# EAGLE design HelvePicV2_0fSMD (EAGLE 7.5.0)
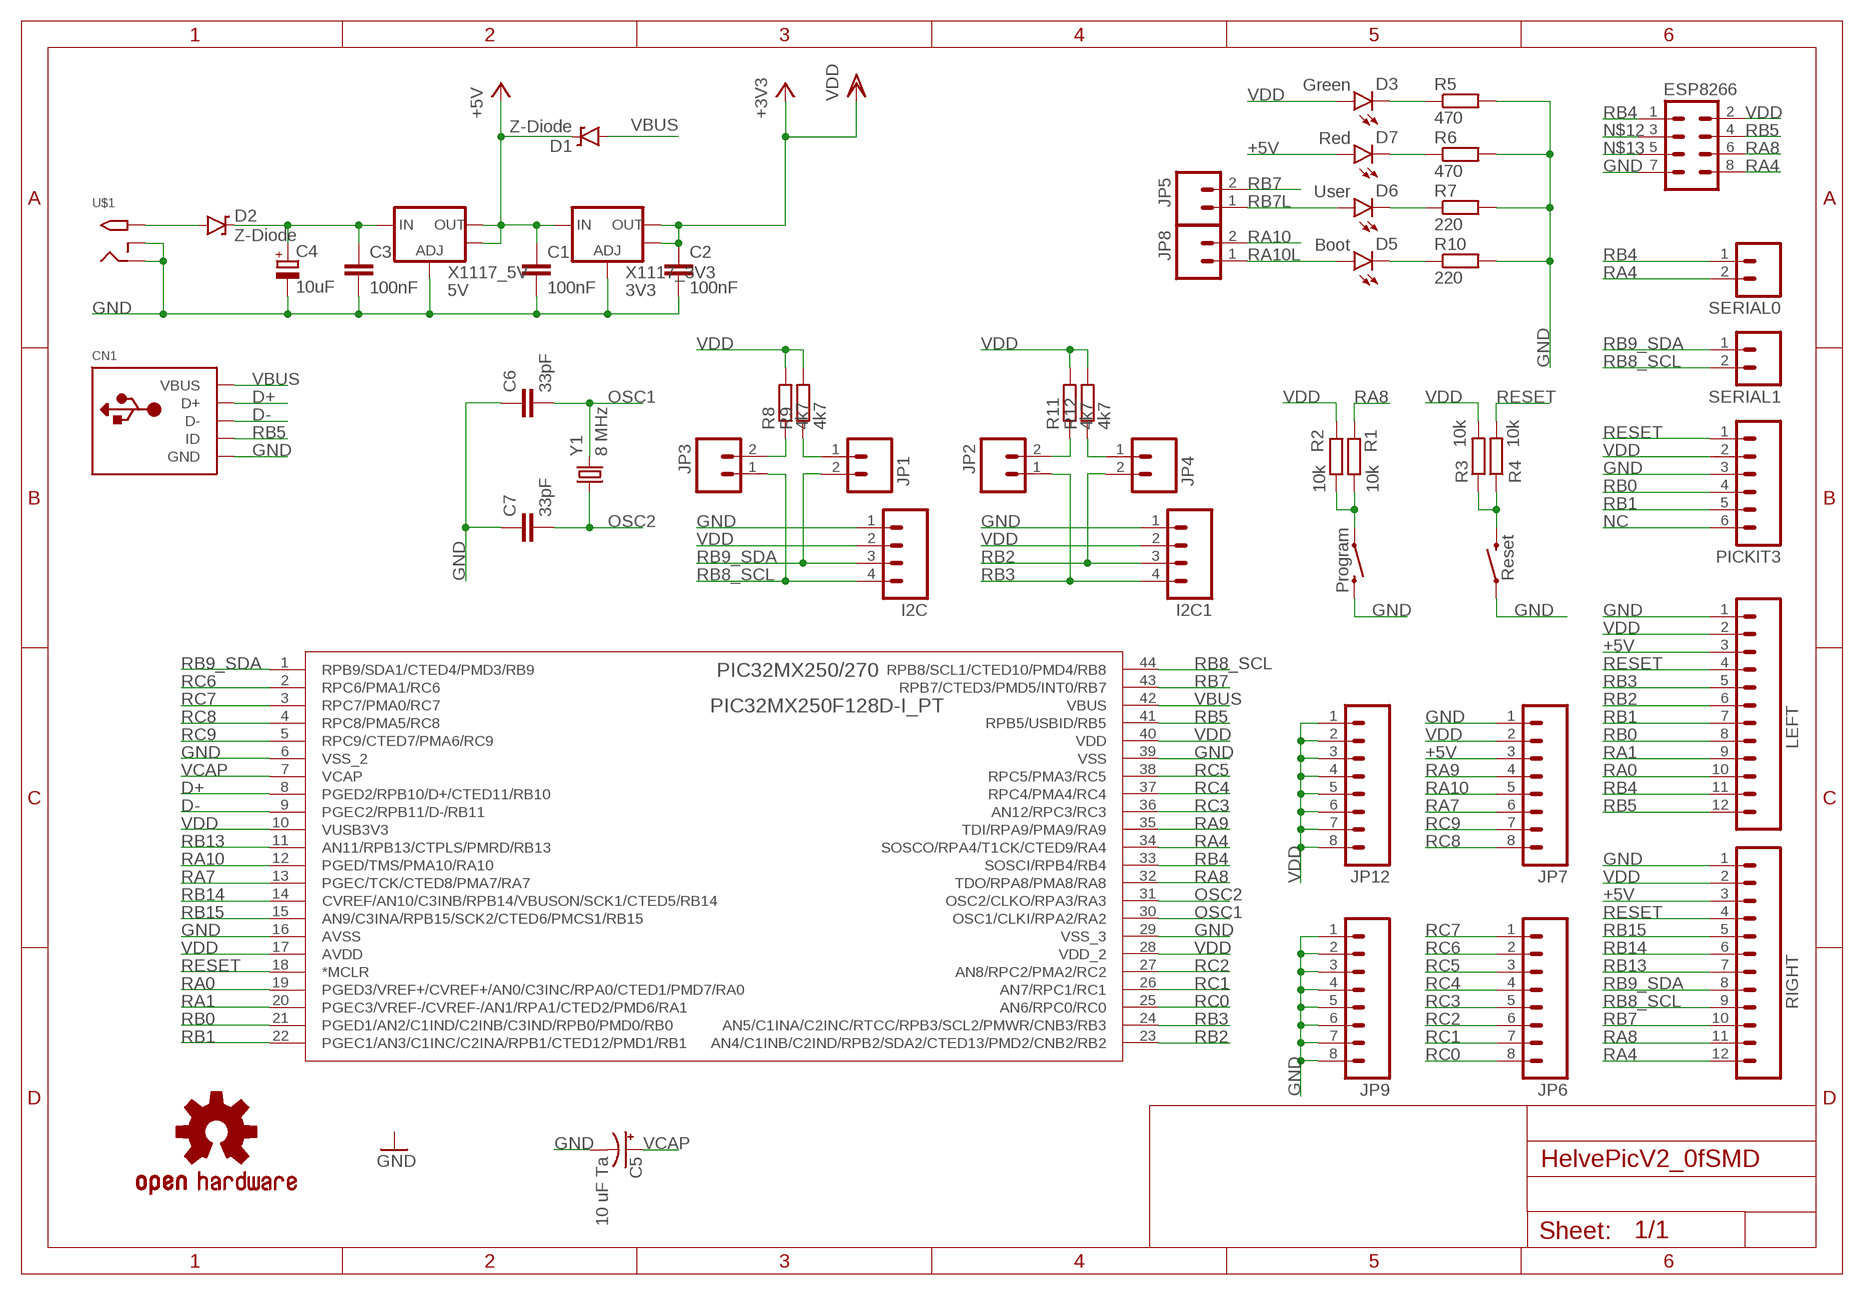
[diagram p0: schematic, sheet 1]

## Parts
C1  100nF  C-EUC1206  [C1206]
C2  100nF  C-EUC1206  [C1206]
C3  100nF  C-EUC1206  [C1206]
C4  10uF  CPOL-EU153CLV-0810  [153CLV-0810]
C5  10 uF Ta  CAP_POL1206  [EIA3216]
C6  33pF  C-EUC1206  [C1206]
C7  33pF  C-EUC1206  [C1206]
CN1  USBMINIB  [USB-MINIB]
D1  Z-Diode  DIODE-ZENERSMB  [SMB-DIODE]
D2  Z-Diode  DIODE-ZENERSMB  [SMB-DIODE]
D3  Green  LED1206  [LED-1206]
D5  Boot  LED1206  [LED-1206]
D6  User  LED1206  [LED-1206]
D7  Red  LED1206  [LED-1206]
ESP8266  M04X2  [2X4]
I2C  M04PTH  [1X04]
I2C1  M04PTH  [1X04]
JP1  M02PTH  [1X02]
JP2  M02PTH  [1X02]
JP3  M02PTH  [1X02]
JP4  M02PTH  [1X02]
JP5  M02PTH  [1X02]
JP6  M081X08  [1X08]
JP7  M081X08  [1X08]
JP8  M02PTH  [1X02]
JP9  M081X08  [1X08]
JP12  M081X08  [1X08]
LEFT  M12PTH  [1X12]
LOGO1  OSHW-LOGOS  [OSHW-LOGO-S]
PIC32MX250/270  PIC32MX250F128D-I_PT  [QFP44_10X10MC]
PICKIT3  M06LOCK  [1X06_LOCK]
R1  10k  R-EU_R1206  [R1206]
R2  10k  R-EU_R1206  [R1206]
R3  10k  R-EU_R1206  [R1206]
R4  10k  R-EU_R1206  [R1206]
R5  470  R-EU_R1206  [R1206]
R6  470  R-EU_R1206  [R1206]
R7  220  R-EU_R1206  [R1206]
R8  4k7  R-EU_R1206  [R1206]
R9  4k7  R-EU_R1206  [R1206]
R10  220  R-EU_R1206  [R1206]
R11  4k7  R-EU_R1206  [R1206]
R12  4k7  R-EU_R1206  [R1206]
RIGHT  M12PTH  [1X12]
S1  Program  SWITCH-MOMENTARY-2SMD-4  [TACTILE_SWITCH_TALL]
S3  Reset  SWITCH-MOMENTARY-2SMD-4  [TACTILE_SWITCH_TALL]
SERIAL0  M02PTH  [1X02]
SERIAL1  M02PTH  [1X02]
U$1  2.1MMJACKTHM  [PJ-102A]
X1117_3V3  3V3  V_REG_LM1117SOT223  [SOT223]
X1117_5V  5V  V_REG_LM1117SOT223  [SOT223]
Y1  8 MHz  CRYSTALSMD  [HC49UP]

## Nets
+5V [power]: C1.1 D1.C D7.A JP7.3 LEFT.3 RIGHT.3 X1117_3V3.3(IN) X1117_5V.2(OUT) X1117_5V.4(OUT)
D+: CN1.D+ PIC32MX250/270.8(PGED2/RPB10/D+/CTED11/RB10)
D-: CN1.D- PIC32MX250/270.9(PGEC2/RPB11/D-/RB11)
GND: C1.2 C2.2 C3.2 C4.- C5.C(-) C6.1 C7.1 CN1.GND ESP8266.7 I2C1.1 I2C.1 JP7.1 JP9.1 JP9.2 JP9.3 JP9.4 JP9.5 JP9.6 JP9.7 JP9.8 LEFT.1 PIC32MX250/270.6(VSS_2) PIC32MX250/270.16(AVSS) PIC32MX250/270.29(VSS_3) PIC32MX250/270.39(VSS) PICKIT3.3 R5.2 R6.2 R7.2 R10.2 RIGHT.1 S1.B2 S3.A2 U$1.RING U$1.RING_SW X1117_3V3.1(ADJ) X1117_5V.1(ADJ)
N$1: JP3.2 R8.1
N$2: D3.C R5.1
N$3: D7.C R6.1
N$4: JP1.1 R9.1
N$5: D2.A U$1.TIP
N$6: JP2.2 R11.1
N$7: JP4.1 R12.1
N$8 [power]: C3.1 C4.+ D2.C X1117_5V.3(IN)
N$9: R1.2 R2.2 S1.A2
N$10: R3.1 R4.1 S3.B2
N$12: ESP8266.3
N$13: ESP8266.5
NC: PICKIT3.6
OSC1: C6.2 PIC32MX250/270.30(OSC1/CLKI/RPA2/RA2) Y1.2
OSC2: C7.2 PIC32MX250/270.31(OSC2/CLKO/RPA3/RA3) Y1.1
RA0: LEFT.10 PIC32MX250/270.19(PGED3/VREF+/CVREF+/AN0/C3INC/RPA0/CTED1/PMD7/RA0)
RA1: LEFT.9 PIC32MX250/270.20(PGEC3/VREF-/CVREF-/AN1/RPA1/CTED2/PMD6/RA1)
RA4: ESP8266.8 PIC32MX250/270.34(SOSCO/RPA4/T1CK/CTED9/RA4) RIGHT.12 SERIAL0.2
RA7: JP7.6 PIC32MX250/270.13(PGEC/TCK/CTED8/PMA7/RA7)
RA8: ESP8266.6 PIC32MX250/270.32(TDO/RPA8/PMA8/RA8) R1.1 RIGHT.11
RA9: JP7.4 PIC32MX250/270.35(TDI/RPA9/PMA9/RA9)
RA10: JP7.5 JP8.2 PIC32MX250/270.12(PGED/TMS/PMA10/RA10)
RA10L: D5.A JP8.1
RB0: LEFT.8 PIC32MX250/270.21(PGED1/AN2/C1IND/C2INB/C3IND/RPB0/PMD0/RB0) PICKIT3.4
RB1: LEFT.7 PIC32MX250/270.22(PGEC1/AN3/C1INC/C2INA/RPB1/CTED12/PMD1/RB1) PICKIT3.5
RB2: I2C1.3 JP4.2 LEFT.6 PIC32MX250/270.23(AN4/C1INB/C2IND/RPB2/SDA2/CTED13/PMD2/CNB2/RB2)
RB3: I2C1.4 JP2.1 LEFT.5 PIC32MX250/270.24(AN5/C1INA/C2INC/RTCC/RPB3/SCL2/PMWR/CNB3/RB3)
RB4: ESP8266.1 LEFT.11 PIC32MX250/270.33(SOSCI/RPB4/RB4) SERIAL0.1
RB5: CN1.ID ESP8266.4 LEFT.12 PIC32MX250/270.41(RPB5/USBID/RB5)
RB7: JP5.2 PIC32MX250/270.43(RPB7/CTED3/PMD5/INT0/RB7) RIGHT.10
RB7L: D6.A JP5.1
RB8_SCL: I2C.4 JP3.1 PIC32MX250/270.44(RPB8/SCL1/CTED10/PMD4/RB8) RIGHT.9 SERIAL1.2
RB9_SDA: I2C.3 JP1.2 PIC32MX250/270.1(RPB9/SDA1/CTED4/PMD3/RB9) RIGHT.8 SERIAL1.1
RB13: PIC32MX250/270.11(AN11/RPB13/CTPLS/PMRD/RB13) RIGHT.7
RB14: PIC32MX250/270.14(CVREF/AN10/C3INB/RPB14/VBUSON/SCK1/CTED5/RB14) RIGHT.6
RB15: PIC32MX250/270.15(AN9/C3INA/RPB15/SCK2/CTED6/PMCS1/RB15) RIGHT.5
RC0: JP6.8 PIC32MX250/270.25(AN6/RPC0/RC0)
RC1: JP6.7 PIC32MX250/270.26(AN7/RPC1/RC1)
RC2: JP6.6 PIC32MX250/270.27(AN8/RPC2/PMA2/RC2)
RC3: JP6.5 PIC32MX250/270.36(AN12/RPC3/RC3)
RC4: JP6.4 PIC32MX250/270.37(RPC4/PMA4/RC4)
RC5: JP6.3 PIC32MX250/270.38(RPC5/PMA3/RC5)
RC6: JP6.2 PIC32MX250/270.2(RPC6/PMA1/RC6)
RC7: JP6.1 PIC32MX250/270.3(RPC7/PMA0/RC7)
RC8: JP7.8 PIC32MX250/270.4(RPC8/PMA5/RC8)
RC9: JP7.7 PIC32MX250/270.5(RPC9/CTED7/PMA6/RC9)
RESET: LEFT.4 PIC32MX250/270.18(*MCLR) PICKIT3.1 R4.2 RIGHT.4
VBUS: CN1.VBUS D1.A PIC32MX250/270.42(VBUS)
VCAP: C5.A(+) PIC32MX250/270.7(VCAP)
VDD [power]: C2.1 D3.A ESP8266.2 I2C1.2 I2C.2 JP7.2 JP12.1 JP12.2 JP12.3 JP12.4 JP12.5 JP12.6 JP12.7 JP12.8 LEFT.2 PIC32MX250/270.10(VUSB3V3) PIC32MX250/270.17(AVDD) PIC32MX250/270.28(VDD_2) PIC32MX250/270.40(VDD) PICKIT3.2 R2.1 R3.2 R8.2 R9.2 R11.2 R12.2 RIGHT.2 X1117_3V3.2(OUT) X1117_3V3.4(OUT) ; supply symbol labelled +3V3
YELLOW: D6.C R7.1
YELLOW1: D5.C R10.1

## Library data of the parts
C1-C3 C6 C7 = rcl:C-EU: CAPACITOR, European symbol
C4 = rcl:CPOL-EU: POLARIZED CAPACITOR, European symbol
C5 = SparkFun-Capacitors:CAP_POL: Capacitor Polarized These are standard SMD and PTH capacitors. Normally 10uF, 47uF, and 100uF in electrolytic and tantalum varieties. Always verify the external diameter of the through hole cap, it varies with capacity, voltage, and manufacturer. The EIA devices should be standard.
CN1 = adafruit:USB: USB Connectors USBMINIB - Surface Mount Female Mini-B USB Connector 4UConnector: 06564 By microbuilder.eu Thru-hole RA Female Mini-B USB Connector 4UConnector: 18732 By ladyada.net
D1 D2 = SparkFun-DiscreteSemi:DIODE-ZENER: Zener Diode Production Part - 8199 3.4V Zener Voltage
D3 D5-D7 = SparkFun-LED:LED: LEDs Standard schematic elements and footprints for 5mm, 3mm, 1206, and 0603 sized LEDs. 5mm - Spark Fun Electronics SKU : COM-00529 (and others)
ESP8266 = SparkFun-Connectors:M04X2: .1" header, two rows of four.
I2C I2C1 = SparkFun-Connectors:M04: Header 4 Standard 4-pin 0.1" header. Use with straight break away headers (SKU : PRT-00116), right angle break away headers (PRT-00553), swiss pins (PRT-00743), machine pins (PRT-00117), and female headers (PRT-00115). Molex polarized connector foot print use with SKU : PRT-08231 with associated crimp pins and housings. 1MM SMD Version SKU: PRT-10208
JP1-JP5 JP8 SERIAL0 SERIAL1 = SparkFun-Connectors:M02: Standard 2-pin 0.1" header. Use with - straight break away headers ( PRT-00116) - right angle break away headers (PRT-00553) - swiss pins (PRT-00743) - machine pins (PRT-00117) - female headers (PRT-00115) Molex polarized connector foot print use with: PRT-08233 with associated crimp pins and housings. 2.54_SCREWTERM for use with PRT-10571. 3.5mm Screw Terminal footprints for PRT-08084 5mm Screw Terminal footprints for use with PRT-08432
JP6 JP7 JP9 JP12 = SparkFun-Connectors:M08: Header 8 Standard 8-pin 0.1" header. Use with straight break away headers (SKU : PRT-00116), right angle break away headers (PRT-00553), swiss pins (PRT-00743), machine pins (PRT-00117), and female headers (PRT-00115).
LEFT RIGHT = SparkFun-Connectors:M12: Header 12 Standard 12-pin 0.1" header. Use with straight break away headers (SKU : PRT-00116), right angle break away headers (PRT-00553), swiss pins (PRT-00743), machine pins (PRT-00117), and female headers (PRT-00115).
LOGO1 = SparkFun-Aesthetics:OSHW-LOGO: Open Source Hardware Logo This logo indicates the piece of hardware it is found on incorporates a OSHW license and/or adheres to the definition of open source hardware found here: http://freedomdefined.org/OSHW
PIC32MX250/270 = myPIC:PIC32MX250F128D-I_PT
PICKIT3 = SparkFun-Connectors:M06: Header 6 Standard 6-pin 0.1" header. Use with straight break away headers (SKU : PRT-00116), right angle break away headers (PRT-00553), swiss pins (PRT-00743), machine pins (PRT-00117), and female headers (PRT-00115). Molex polarized connector foot print use with SKU : PRT-08094 with associated crimp pins and housings. NOTES ON THE VARIANTS LOCK and LOCK_LONGPADS... This footprint was designed to help hold the alignment of a through-hole component (i.e. 6-pin header) while soldering it into place. You may notice that each hole has been shifted either up or down by 0.005 of an inch from it's more standard position (which is a perfectly straight line). This slight alteration caused the pins (the squares in the middle) to touch the edges of the holes. Because they are alternating, it causes a "brace" to hold the component in place. 0.005 has proven to be the perfect amount of "off-center" position when using our standard breakaway headers. Although looks a little odd when you look at the bare footprint, once you have a header in there, the alteration is very hard to notice. Also,if you push a header all the way into place, it is covered up entirely on the bottom side. This idea of altering the position of holes to aid alignment will be further integrated into the Sparkfun Library for other footprints. It can help hold any component with 3 or more connection pins.
R1-R12 = rcl:R-EU_: RESISTOR, European symbol
S1 S3 = SparkFun-Electromechanical:SWITCH-MOMENTARY-2: Various NO switches- pushbuttons, reed, etc; PROD_ID: SWCH-11966
U$1 = adafruit:2.1MMJACK: 2.1mm x 5.5mm THM DC jack with internal switch. Digikey part #PJ-102A, 4UCON part #05537 2.1mm x 5.5mm SMT DC jack with internal switch. Digikey part #PJ-002A-SMT, 4UCON part #03267 By microbuilder.eu & adafruit.com
X1117_3V3 X1117_5V = SparkFun-PowerIC:V_REG_LM1117: Voltage Regulator LM1117 Standard adjustable voltage regulator but in SMD form. Spark Fun Electronics SKU : COM-00595
Y1 = SparkFun-FreqCtrl:CRYSTAL: Various standard crystals. Proven footprints.

## Net classes
1 power: width 0.203 mm

## Board
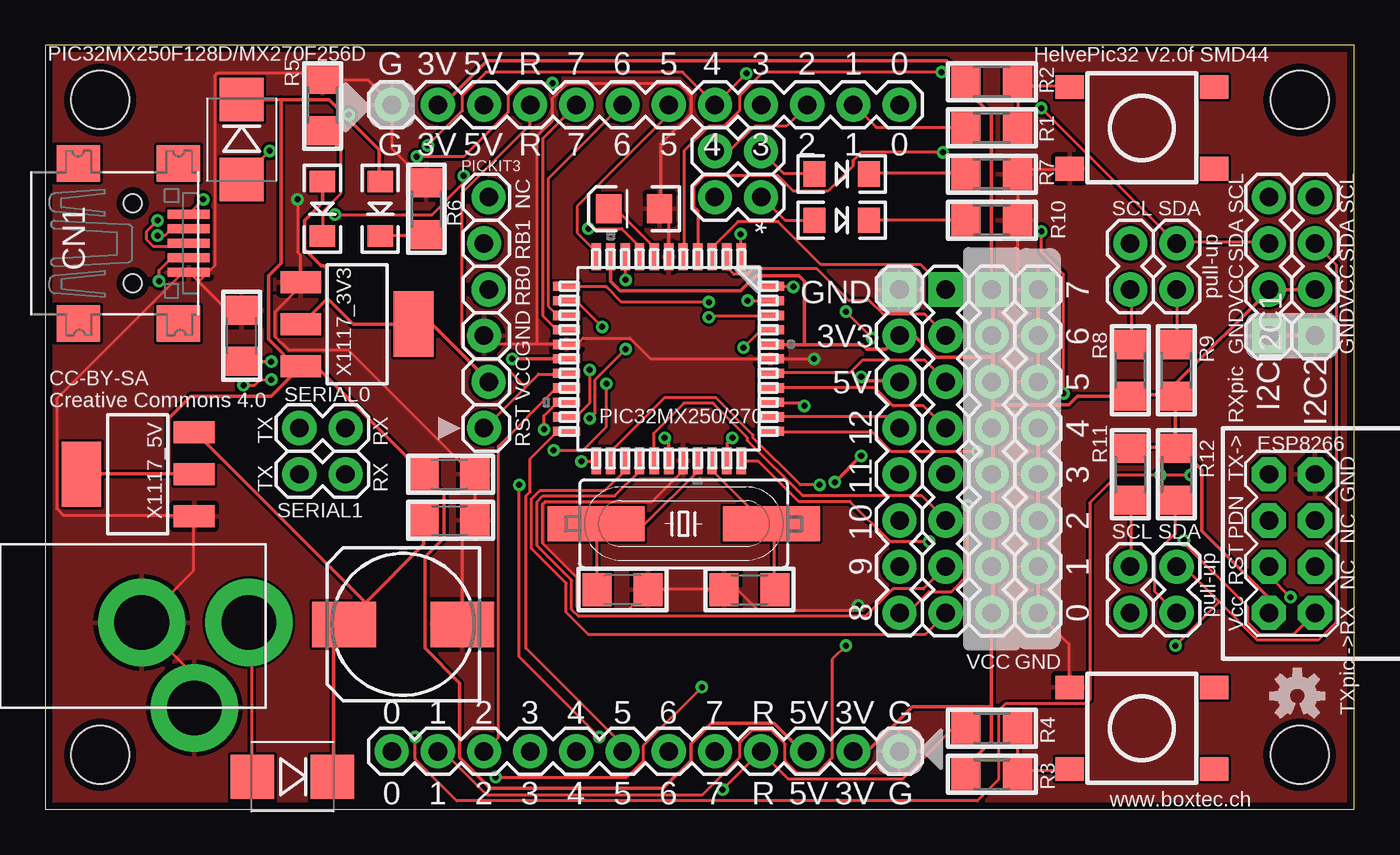
[diagram p1: board, top side]
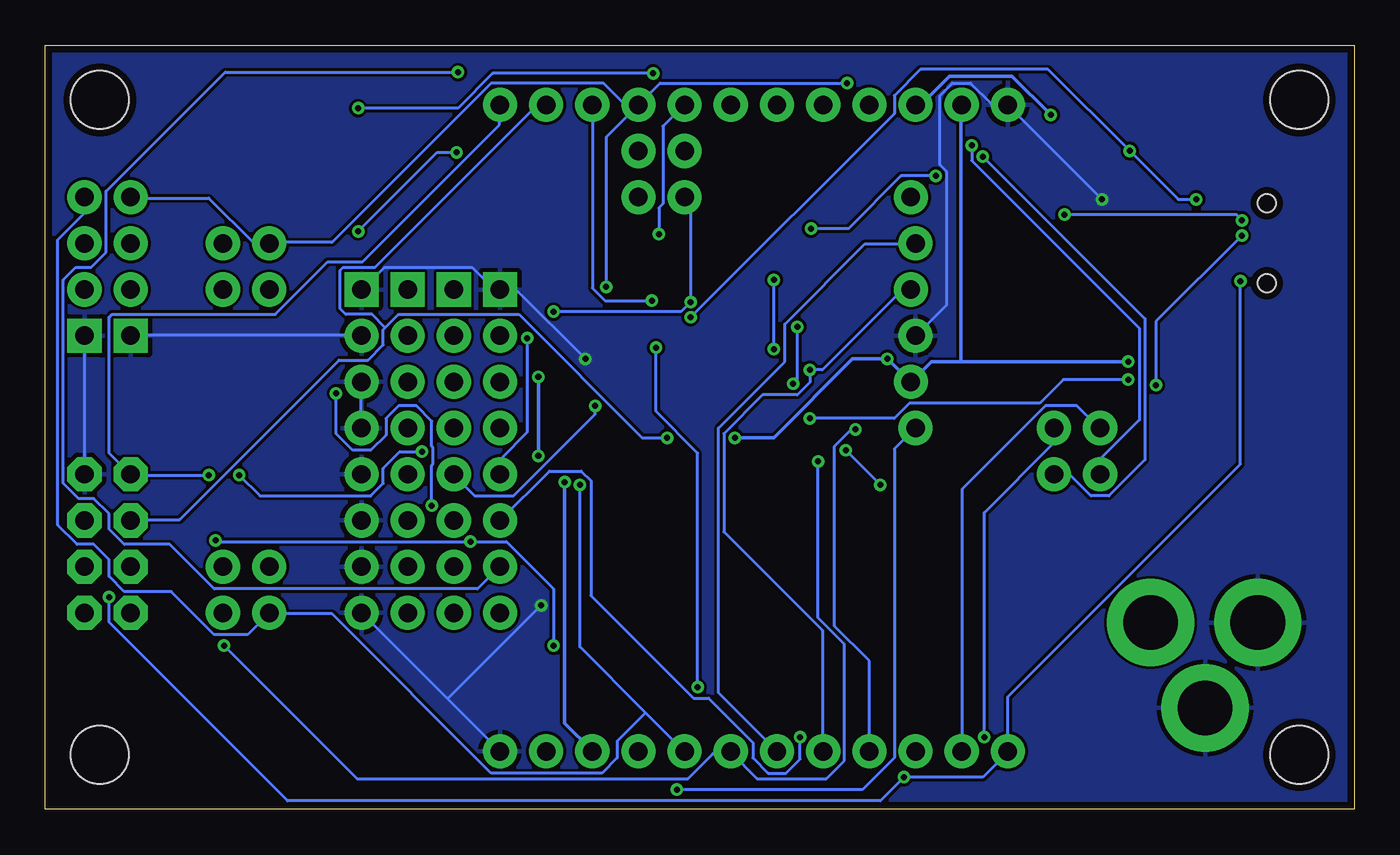
[diagram p2: board, bottom side, seen from below]

Size 72 x 42 mm. Coordinates in mm from the lower left corner, seen from the top.
Outline: 0,0 72,0 72,42 0,42 0,0
Copper layers (1*16): Top 0.0356mm / dielectric 1.5011mm / Bottom 0.0356mm
Design rules "oshpark-2layer": minimum track width 6mil, minimum drill 13mil, track to track 6mil, track to pad 6mil, pad to pad 6mil, via to via 6mil, smd to smd 6mil, copper to edge 15mil, drill to drill 6mil, minimum pad ring 7mil, minimum via ring 7mil, stop-mask expansion 4mil, vias tented up to drill 0mil, thermal gap 10mil
Holes 3.2 mm at 3,3 69,3 69,39 3,39

### Footprints (pad centres in the part's own frame; a part is rotated, then mirrored left to right if it is on the bottom)
C1206 = smd 1.6 x 1.8: 1 -1.4,0; 2 1.4,0
153CLV-0810 = smd 3.5 x 2.5: + 3.25,0; - -3.25,0
EIA3216 = smd 1.4 x 1.6: A 1.4,0; C -1.4,0
USB-MINIB = smd 0.5 x 2.308: D+ 0,4.064; D- -0.8,4.064; GND 1.6,4.064; ID 0.8,4.064; VBUS -1.6,4.064 | smd 2 x 2.4: GND1 -4.4,-2; GND2 -4.4,3.5; GND3 4.4,3.5; GND4 4.4,-2 | hole 1: -2.2,1; 2.2,1
SMB-DIODE = smd 2.4 x 2.4: A 2.2,0; C -2.2,0
LED-1206 = smd 1.2 x 1.4: A -1.5,0; C 1.5,0
2X4 = drill 1.016 pad 1.88 octagon: 1 -3.81,-1.27; 2 -3.81,1.27; 3 -1.27,-1.27; 4 -1.27,1.27; 5 1.27,-1.27; 6 1.27,1.27; 7 3.81,-1.27; 8 3.81,1.27
1X04 = drill 1.016 pad 1.88 square: 1 0,0 | drill 1.016 pad 1.88: 2 2.54,0; 3 5.08,0; 4 7.62,0
1X02 = drill 1.016 pad 1.88: 1 0,0; 2 2.54,0
1X08 = drill 1.016 pad 1.88 square: 1 0,0 | drill 1.016 pad 1.88: 2 2.54,0; 3 5.08,0; 4 7.62,0; 5 10.16,0; 6 12.7,0; 7 15.24,0; 8 17.78,0
1X12 = drill 1.016 pad 1.88: 1 0,0; 2 2.54,0; 3 5.08,0; 4 7.62,0; 5 10.16,0; 6 12.7,0; 7 15.24,0; 8 17.78,0; 9 20.32,0; 10 22.86,0; 11 25.4,0; 12 27.94,0
QFP44_10X10MC = smd 1.473 x 0.508: 1 -5.613,3.988; 2 -5.613,3.2; 3 -5.613,2.388; 4 -5.613,1.6; 5 -5.613,0.787; 6 -5.613,0; 7 -5.613,-0.787; 8 -5.613,-1.6; 9 -5.613,-2.388; 10 -5.613,-3.2; 11 -5.613,-3.988; 23 5.613,-3.988; 24 5.613,-3.2; 25 5.613,-2.388; 26 5.613,-1.6; 27 5.613,-0.787; 28 5.613,0; 29 5.613,0.787; 30 5.613,1.6; 31 5.613,2.388; 32 5.613,3.2; 33 5.613,3.988 | smd 0.508 x 1.473: 12 -3.988,-5.613; 13 -3.2,-5.613; 14 -2.388,-5.613; 15 -1.6,-5.613; 16 -0.787,-5.613; 17 0,-5.613; 18 0.787,-5.613; 19 1.6,-5.613; 20 2.388,-5.613; 21 3.2,-5.613; 22 3.988,-5.613; 34 3.988,5.613; 35 3.2,5.613; 36 2.388,5.613; 37 1.6,5.613; 38 0.787,5.613; 39 0,5.613; 40 -0.787,5.613; 41 -1.6,5.613; 42 -2.388,5.613; 43 -3.2,5.613; 44 -3.988,5.613
1X06_LOCK = drill 1.016 pad 1.88: 1 0,0; 2 2.54,-0.254; 3 5.08,0; 4 7.62,-0.254; 5 10.16,0; 6 12.7,-0.254
R1206 = smd 1.6 x 1.803: 1 -1.422,0; 2 1.422,0
TACTILE_SWITCH_TALL = smd 1.55 x 1.3: A1 -3.975,-2.25; A2 3.975,-2.25; B1 -3.975,2.25; B2 3.975,2.25
PJ-102A = drill 3 pad 4.8: RING 0.1,-3.39; RING_SW -4.6,-6.29; TIP 0.1,-9.29
SOT223 = smd 1.219 x 2.235: 1 -2.311,-3.099; 2 0,-3.099; 3 2.311,-3.099 | smd 3.6 x 2.2: 4 0,3.099
HC49UP = smd 5.334 x 1.93: 1 -4.826,0; 2 4.826,0

### Placement (x,y rotation side)
C1  22.23,18.41 0 top
C2  10.8,26.04 90 top
C3  22.23,15.88 0 top
C4  19.69,10.16 180 top
C5  32.39,33.02 180 top
C6  31.75,12.06 180 top
C7  38.74,12.06 0 top
CN1  3.81,31.11 270 top
D1  10.8,36.83 270 top
D2  13.59,1.78 180 top
D3  15.24,33.02 270 top
D5  43.82,32.38 0 top
D6  43.82,34.92 0 top
D7  18.42,33.02 270 top
ESP8266  68.58,14.61 90 top
I2C  67.31,26.04 90 top
I2C1  69.85,26.04 90 top
JP1  62.23,28.57 90 top
JP2  59.69,10.79 90 top
JP3  59.69,31.11 270 top
JP4  62.23,10.79 90 top
JP5  39.37,36.2 180 top
JP6  49.53,28.57 270 top
JP7  46.99,28.57 270 top
JP8  39.37,33.66 180 top
JP9  54.61,28.57 270 top
JP12  52.07,28.57 270 top
LEFT  46.99,3.17 180 top
LOGO1  68.88,6.22 0 top
PIC32MX250/270  34.29,24.77 270 top
PICKIT3  24.13,20.95 90 top
R1  52.07,37.47 0 top
R2  52.07,40.01 0 top
R3  52.07,1.91 180 top
R4  52.07,4.45 180 top
R5  15.24,38.73 90 top
R6  20.96,33.02 90 top
R7  52.07,34.92 0 top
R8  59.69,24.13 270 top
R9  62.23,24.13 270 top
R10  52.07,32.38 0 top
R11  59.69,18.41 90 top
R12  62.23,18.41 90 top
RIGHT  19.05,38.73 0 top
S1  60.33,37.47 180 top
S3  60.33,4.45 180 top
SERIAL0  13.97,20.95 0 top
SERIAL1  13.97,18.41 0 top
U$1  1.91,10.16 90 top
X1117_3V3  17.15,26.67 270 top
X1117_5V  5.08,18.41 90 top
Y1  35.11,15.69 180 top

### Tracks (layer width: path | path; a pad name or v marks a point on that pad's centre or on a via)
+5V  (via drill 0.33)
  Top 0.203: 16.57,38.06 15.62,39.01 12.96,39.01 | 16.57,38.06 18.37,36.27 18.37,34.59 D7.A | 12.96,39.01 10.82,39.01 D1.C | 16.57,38.06 v16.69,38.18 | 6.78,18.44 1.98,18.44 X1117_5V.4 | 6.78,18.44 8.15,18.44 X1117_5V.2 | X1117_3V3.3 14.1,24.31 14.94,24.31 20.8,18.44 C1.1 20.88,18.36 21.95,17.3 21.95,14.94 20.88,13.87 20.88,8.84 22.79,6.93 22.79,2.82 24.46,1.14 33.99,1.14 35.51,2.67 35.51,3.58 36.65,4.72 40.08,4.72 41.61,3.2 41.91,3.2 LEFT.3 | v44.88,23.77 45.11,23.55 46.94,23.55 JP7.3 | v43.44,17.98 v44.88,19.43 | 6.78,18.44 6.78,21.49 8,22.71 12.42,22.71 14.02,24.31 X1117_3V3.3 | 12.96,39.01 12.96,30.02 12.27,29.34 12.27,25.83 13.87,24.23 X1117_3V3.3
  Bottom 0.203: v16.69,38.18 18.82,40.31 22.25,40.31 23.78,38.79 24.08,38.79 RIGHT.3 | v44.88,19.43 v44.88,23.77 | v43.44,17.98 43.44,4.72 41.91,3.2 LEFT.3
D+  (via drill 0.33)
  Top 0.152: PIC32MX250/270.8 32.69,30.94 31.7,31.93 v29.87,31.93 | v23.01,34.82 23.01,34.44 21.26,32.69 v15.93,32.69 | v6.17,32.38 5.56,31.77 5.56,31.32 5.95,30.94 7.7,30.94 CN1.D+
  Bottom 0.152: v29.87,31.93 27.81,31.93 24.92,34.82 v23.01,34.82 | v15.93,32.69 6.48,32.69 v6.17,32.38
D-  (via drill 0.33)
  Top 0.152: v31.93,29.11 31.93,30.33 PIC32MX250/270.9 | v31.93,25.3 30.25,23.62 30.25,21.79 v29.95,21.49 | v12.42,23.62 11.81,23.62 11.51,23.32 v10.9,23.32 | v6.17,31.55 6.55,31.55 6.86,31.85 7.85,31.85 CN1.D-
  Bottom 0.152: v31.93,25.3 v31.93,29.11 | v29.95,21.49 25.3,21.49 24.46,22.33 17.3,22.33 16,23.62 v12.42,23.62 | v10.9,23.32 10.9,26.82 v6.17,31.55
GND  (via drill 0.33)
  Top 0.152: PIC32MX250/270.29 35.05,19.13 35.05,18.59 33.38,16.92 27.51,16.92 27.36,16.76 27.36,14.63 29.26,12.72 29.26,11.12 29.49,10.9 32.01,10.9 33.15,12.04 C6.1 33.22,12.12 37.26,12.12 C7.1 37.34,12.04 38.1,12.04 39.24,10.9 44.43,10.9 v44.73,11.2 | S3.A2 56.31,6.71 56.31,9.07 54.64,10.74 JP9.8 54.64,10.82 54.64,13.34 | S1.B2 56.31,35.2 53.72,35.2 53.49,34.98 R7.2 53.49,34.9 R10.2 | R10.2 53.49,29.64 54.56,28.57 JP9.1 54.64,28.57 54.64,26.06 JP9.2 54.64,25.98 54.64,23.55 JP9.3 | R10.2 | I2C.1 67.36,26.06 69.8,26.06 I2C1.1 | 54.64,13.34 54.64,15.85 JP9.6 54.64,15.93 54.64,18.36 JP9.5 54.64,18.44 54.64,20.95 JP9.4 | 54.64,13.34 JP9.7 | U$1.RING_SW 8.15,5.56 8.15,7.39 5.34,10.21 U$1.RING 5.34,10.29 8.15,13.11 8.15,16.08 X1117_5V.1 8.15,16.15 0.99,16.15 0.61,16.54 0.61,22.55 7.55,29.49 7.85,29.49 CN1.GND 7.93,29.49 8.42,28.99 | C4.- 22.94,10.21 22.94,15.16 23.62,15.85 C3.2 23.62,15.93 23.62,18.36 C1.2 23.55,18.36 16.69,25.22 13.41,25.22 12.65,25.98 12.65,27.36 14.02,28.73 14.02,28.96 X1117_3V3.1 14.02,29.03 14.02,30.48 13.87,30.63 v13.87,33.53 | 8.42,28.99 9.91,27.51 10.75,27.51 C2.2 | R6.2 19.05,36.35 RIGHT.1 19.05,38.79 17.76,40.08 15.24,40.08 R5.2 | R6.2 | 8.42,28.99 9.3,29.87 9.3,40.31 9.45,40.46 14.94,40.46 R5.2 | R5.2 | PIC32MX250/270.6 34.29,32.54 33.83,32.99 C5.C 33.83,33.07 33.83,36.58 35.51,38.25 35.51,39.24 34.82,39.93 28.73,39.93 27.89,39.09 27.89,37.87 27.05,37.03 27.05,25.6 | 27.05,25.6 24.54,25.6 24.16,25.98 PICKIT3.3 | 27.05,25.6 28.65,25.6 PIC32MX250/270.16 28.73,25.6 29.26,25.6 29.57,25.91 32.16,25.91 33.3,24.77 PIC32MX250/270.39 v42.29,24.77
  Bottom 0.152: JP9.8 49.87,6.06 | 49.87,6.06 LEFT.1 | 49.87,6.06 v44.73,11.2 | JP9.1 54.56,28.57 53.34,29.79 48.54,29.79 47.32,28.57 JP7.1 46.1,28.57 v42.29,24.77 | ESP8266.7 69.88,18.44 69.88,25.98 I2C1.1 | JP9.3 54.64,23.47 54.64,20.95 JP9.4 | I2C.1 67.29,26.06 54.64,26.06 JP9.2 | PICKIT3.3 24.08,26.06 22.4,27.74 22.4,35.05 22.79,35.43 22.79,39.24 22.1,39.93 21.11,39.93 19.97,38.79 19.05,38.79 RIGHT.1 19.05,38.71 v13.87,33.53
  pour Top: 0,41.91 71.76,41.91 71.76,0 0,0
  pour Bottom: 0,41.91 71.76,41.91 71.76,0 0,0
N$1
  Top 0.152: R8.1 59.74,25.6 59.74,28.57 JP3.2
N$2
  Top 0.152: D3.C 15.24,32.84 16.23,33.83 16.23,36.27 15.24,37.26 R5.1
N$3
  Top 0.152: D7.C 18.44,31.55 20.96,31.55 R6.1
N$4
  Top 0.152: R9.1 62.26,25.6 62.26,28.57 JP1.1
N$5
  Top 0.152: D2.A 11.36,1.83 11.36,10.06 11.2,10.21 U$1.TIP
N$6
  Top 0.152: R11.1 59.74,16.99 59.74,13.34 JP2.2
N$7
  Top 0.152: R12.1 62.18,16.99 62.18,15.16 61.04,14.02 61.04,11.96 62.18,10.82 JP4.1
N$8
  Top 0.203: 17.6,11.35 16.46,10.21 C4.+ | 17.6,11.35 20.8,14.55 20.8,15.85 C3.1 | 17.6,11.35 8.23,20.73 X1117_5V.3 | 17.6,11.35 C4.+ | D2.C 15.85,1.83 15.85,9.6 16.38,10.13 C4.+
N$9
  Top 0.152: R2.2 53.72,39.78 56.31,39.78 S1.A2 | R2.2 | R1.2 53.49,37.49 53.49,39.62 53.65,39.78 R2.2
N$10
  Top 0.152: R3.1 53.72,2.13 56.31,2.13 S3.B2 | R3.1 | R4.1 53.49,4.42 53.49,2.29 53.65,2.13 R3.1
OSC1
  Top 0.152: PIC32MX250/270.30 35.89,18.59 33,15.7 30.33,15.7 Y1.2 30.33,15.62 30.33,12.12 C6.2
OSC2
  Top 0.152: PIC32MX250/270.31 36.73,19.13 36.73,18.59 39.63,15.7 Y1.1 40.01,15.62 40.08,15.54 40.08,12.12 C7.2
RA0
  Top 0.152: PIC32MX250/270.19 28.12,23.16 24.92,19.96 24.92,3.96 LEFT.10
RA1  (via drill 0.33)
  Top 0.152: v27.43,20.88 27.43,21.64 28.12,22.33 28.65,22.33 PIC32MX250/270.20
  Bottom 0.152: v27.43,20.88 27.66,20.88 28.58,19.96 28.58,10.06 26.67,8.15 LEFT.9
RA4  (via drill 0.33)
  Top 0.152: v51.28,19.66 46.56,19.66 45.49,20.73 39.93,20.73 PIC32MX250/270.34 | v63.02,18.36 v61.34,18.36 58.98,18.36 57.46,16.84 57.46,6.02 57.23,5.79 52.81,5.79 52.43,5.41 52.43,1.6 51.28,0.46 22.63,0.46 20.35,2.74 v20.35,3.96
  Bottom 0.152: v51.28,19.66 52.5,19.66 53.42,18.75 53.42,17.91 54.1,17.22 60.2,17.22 v61.34,18.36 | v63.02,18.36 67.29,18.36 ESP8266.8 67.36,18.44 68.51,19.58 68.51,27.05 68.35,27.2 59.36,27.2 56.47,30.1 54.56,30.1 47.02,37.64 47.02,38.71 RIGHT.12 | v20.35,3.96 20.35,16.31 16.54,20.12 16.54,20.95 SERIAL0.2
RA7  (via drill 0.33)
  Top 0.152: PIC32MX250/270.13 29.19,27.96 v30.63,26.52 | v30.86,23.39 30.86,21.03 29.57,19.74 v27.97,19.74 | v26.06,17.83 26.06,8.38 v30.48,3.96
  Bottom 0.152: v30.63,26.52 30.63,23.62 v30.86,23.39 | v26.06,17.83 v27.97,19.74 | v30.48,3.96 30.48,2.74 31.24,1.98 32.23,1.98 33.07,2.82 33.07,3.66 35.51,6.1 36.35,6.1 41.99,11.73 41.99,18.06 42.52,18.59 44.27,18.59 JP7.6
RA8  (via drill 0.33)
  Top 0.152: R1.1 50.6,37.49 45.72,37.49 44.5,38.71 RIGHT.11 | PIC32MX250/270.32 37.49,20.12 v37.8,20.42
  Bottom 0.152: v37.8,20.42 39.17,20.42 45.95,27.2 52.58,27.2 53.3,26.48 | 53.3,26.48 53.42,26.36 53.42,25.53 54.26,24.69 55.86,24.69 64.62,15.93 67.29,15.93 ESP8266.6 | 53.3,26.48 54.03,27.2 55.48,27.2 55.78,27.51 55.78,29.64 55.63,29.79 53.87,29.79 44.96,38.71 44.5,38.71 RIGHT.11
RA9
  Top 0.152: PIC32MX250/270.35 46.33,21.57 46.94,20.95 JP7.4
RA10  (via drill 0.33)
  Top 0.152: v36.5,27.89 31.7,27.89 30.86,28.73 28.73,28.73 PIC32MX250/270.12 | v44.05,27.36 v45.49,25.91
  Bottom 0.152: JP8.2 36.81,33.6 36.5,33.3 v36.5,27.89 37.03,27.36 v44.05,27.36 | v45.49,25.91 45.49,20.73 46.94,19.28 46.94,18.44 JP7.5
RA10L
  Top 0.152: D5.A 40.69,32.38 39.4,33.68 JP8.1
RB0  (via drill 0.33)
  Top 0.152: PIC32MX250/270.21 29.19,21.57 29.95,22.33 v29.95,24.16
  Bottom 0.152: PICKIT3.4 24.84,28.57 29.26,24.16 v29.95,24.16 29.95,23.47 30.63,22.78 32.54,22.78 34.67,20.65 34.67,15.24 29.26,9.83 29.26,3.2 LEFT.8
RB1
  Top 0.152: PIC32MX250/270.22 28.65,20.73 28.12,20.73 26.67,19.28 26.67,17.45 26.44,17.22 26.44,8.84 31.7,3.58 31.7,3.2 LEFT.7
  Bottom 0.152: LEFT.7 34.98,6.4 34.98,20.95 31.32,24.61 31.32,26.67 26.9,31.09 24.16,31.09 PICKIT3.5
RB2  (via drill 0.33)
  Top 0.152: v29.49,19.13 30.25,19.13 PIC32MX250/270.23 | JP4.2 62.64,13.34 64.58,11.39 | 64.58,11.39 66.68,9.3 70.03,9.3 71.02,10.29 71.02,29.95 I2C1.3 | 64.58,11.39 v62.18,8.99
  Bottom 0.152: v29.49,19.13 29.49,10.52 28.04,9.07 28.04,2.67 29.03,1.68 32.84,1.68 34.29,3.12 LEFT.6 34.29,3.05 35.28,3.05 36.65,1.68 54.87,1.68 v62.18,8.99
RB3  (via drill 0.33)
  Top 0.152: PIC32MX250/270.24 31.09,19.66 34.06,22.63 36.88,22.63 38.94,20.57 38.94,20.42 41.53,17.83 v42.6,17.83
  Bottom 0.152: v42.6,17.83 42.6,8.91 38.98,5.3 | 38.98,5.3 36.88,3.2 LEFT.5 | 38.98,5.3 40.54,3.73 40.54,2.82 41.38,1.98 47.47,1.98 56.24,10.74 59.67,10.74 JP2.1 60.89,9.6 62.71,9.6 65.08,11.96 67.67,11.96 68.51,12.8 68.51,13.72 69.34,14.55 70.26,14.55 71.32,15.62 71.32,31.32 69.88,32.77 69.88,33.6 I2C1.4
RB4  (via drill 0.33)
  Top 0.152: v48.62,14.71 46.48,14.71 44.27,16.92 41.45,16.92 39.24,19.13 38.33,19.13 PIC32MX250/270.33 | v62.64,14.78 62.64,14.63 66.14,11.12 66.14,10.29 66.83,9.6 68.66,9.6 ESP8266.1 | v44.05,8.99 43.28,8.23 43.28,2.82 42.44,1.98 41.38,1.98 40.69,2.67 40.69,3.58 39.93,4.34 38.86,4.34 38.18,3.66 38.18,2.82 36.12,0.76 24.31,0.76 21.95,3.12 21.64,3.12 LEFT.11
  Bottom 0.152: LEFT.11 21.57,3.2 21.57,17.6 16.99,22.17 15.24,22.17 14.02,20.95 SERIAL0.1 | v62.64,14.78 62.56,14.71 v48.62,14.71 46.64,14.71 44.05,12.12 v44.05,8.99
RB5  (via drill 0.33)
  Top 0.152: PIC32MX250/270.41 39.4,26.36 v38.41,25.38 | v36.12,6.71 32.92,3.5 32.92,2.67 32.01,1.75 v24.77,1.75 | v6.25,29.03 6.25,29.64 6.86,30.25 7.85,30.25 CN1.ID | v68.51,11.66 67.36,12.8 67.36,13.34 ESP8266.4
  Bottom 0.152: v38.41,25.38 38.41,21.87 36.12,19.58 v36.12,6.71 | v6.25,29.03 6.25,18.97 19.05,6.17 LEFT.12 19.05,3.12 20.42,1.75 v24.77,1.75 26.06,0.46 58.68,0.46 68.51,10.29 v68.51,11.66
RB7  (via drill 0.33)
  Top 0.152: v38.63,27.96 PIC32MX250/270.43 | JP5.2 37.64,36.2 39.02,37.57 40.77,37.57 41.91,38.71 RIGHT.10
  Bottom 0.152: v38.63,27.96 41.23,27.96 41.91,28.65 RIGHT.10
RB7L
  Top 0.152: D6.A 42.29,34.98 40.62,34.98 39.4,36.2 JP5.1
RB8_SCL  (via drill 0.33)
  Top 0.152: v41.15,28.73 39.93,28.73 PIC32MX250/270.44 | v20.42,35.89 23.01,35.89 25.45,38.33 25.45,39.24 26.14,39.93 v27.89,39.93
  Bottom 0.152: I2C.4 67.29,33.6 63.02,33.6 60.58,31.17 59.74,31.17 JP3.1 59.67,31.17 56.24,31.17 47.47,39.93 41.3,39.93 39.78,38.41 RIGHT.9 | v41.15,28.73 41.15,36.96 RIGHT.9 | v20.42,35.89 11.51,26.98 11.51,19.2 13.49,17.22 14.48,17.22 15.62,18.36 16.46,18.36 SERIAL1.2 | v27.89,39.93 38.18,39.93 RIGHT.9
RB9_SDA  (via drill 0.33)
  Top 0.152: I2C.3 67.29,31.17 62.26,31.17 JP1.2 v54.79,38.56 | v38.25,31.62 38.25,30.4 PIC32MX250/270.1 | v21.03,36.5 22.94,38.41 22.94,39.24 24.23,40.54 35.05,40.54 36.81,38.79 RIGHT.8 v38.56,40.46
  Bottom 0.152: v38.25,31.62 38.25,33.07 38.03,33.3 38.03,37.57 36.88,38.71 RIGHT.8 | v21.03,36.5 21.03,35.66 11.81,26.44 11.81,21.41 13.95,19.28 13.95,18.44 SERIAL1.1 | v54.79,38.56 49.3,38.56 47.4,40.46 v38.56,40.46
RB13
  Top 0.152: RIGHT.7 34.29,38.18 29.26,33.15 29.26,31.7 30.25,30.71 30.25,30.4 PIC32MX250/270.11
RB14
  Top 0.152: PIC32MX250/270.14 28.65,27.2 28.12,27.2 27.66,27.66 27.66,34.67 31.7,38.71 RIGHT.6
RB15
  Top 0.152: PIC32MX250/270.15 28.12,26.36 27.36,27.13 27.36,36.88 RIGHT.5
RC0
  Top 0.152: PIC32MX250/270.25 31.85,19.13 31.85,18.59 30.79,17.53 27.2,17.53 26.75,17.07 26.75,14.33 28.65,12.42 28.65,10.82 29.87,9.6 48.39,9.6 49.53,10.74 JP6.8
RC1
  Top 0.152: PIC32MX250/270.26 32.69,18.59 31.32,17.22 27.36,17.22 27.05,16.92 27.05,14.48 28.96,12.57 28.96,10.97 29.34,10.59 45.11,10.59 46.64,12.12 48.31,12.12 JP6.7
RC2
  Top 0.152: PIC32MX250/270.27 33.45,19.2 33.45,20.65 35.13,22.33 36.73,22.33 38.63,20.42 38.63,20.27 41.68,17.22 48.24,17.22 49.53,15.93 JP6.6
RC3  (via drill 0.33)
  Top 0.152: v41.76,22.17 41.61,22.33 39.93,22.33 PIC32MX250/270.36
  Bottom 0.152: v41.76,22.17 41.76,21.72 46.25,17.22 48.39,17.22 49.53,18.36 JP6.5
RC4
  Top 0.152: PIC32MX250/270.37 45.65,23.16 46.64,22.17 48.31,22.17 JP6.4
RC5
  Top 0.152: PIC32MX250/270.38 39.93,24 44.27,24 44.96,24.69 48.39,24.69 49.53,23.55 JP6.3
RC6
  Top 0.152: PIC32MX250/270.2 37.49,29.79 37.87,29.41 38.63,29.41 38.94,29.72 42.44,29.72 44.2,27.96 45.34,27.96 46.1,27.2 48.39,27.2 49.53,26.06 JP6.2
RC7
  Top 0.152: JP6.1 48.16,29.95 42.67,29.95 40.31,32.31 38.1,32.31 36.73,30.94 36.73,30.4 PIC32MX250/270.3
RC8  (via drill 0.33)
  Top 0.152: PIC32MX250/270.4 35.89,32.92 35.66,33.15 35.66,34.21 36.27,34.82 40.31,34.82 41.15,33.98 43.05,33.98 44.43,35.36 44.43,35.66 44.88,36.12 v49.38,36.12 | v54.79,31.77 54.79,30.63 56.01,29.41 v56.01,22.86 | v50.75,16.69 50.75,12.88 49.84,11.96 48.62,11.96 47.47,10.82 47.02,10.82 JP7.8
  Bottom 0.152: v49.38,36.12 50.45,36.12 v54.79,31.77 | v56.01,22.86 56.01,20.65 55.09,19.74 54.1,19.74 53.27,20.57 53.27,21.49 52.58,22.17 51.59,22.17 50.75,21.34 50.75,19.96 50.67,19.89 50.67,18.97 50.75,18.9 v50.75,16.69
RC9  (via drill 0.33)
  Top 0.152: v49.3,40.54 39.47,40.54 38.18,39.24 38.18,38.41 37.34,37.57 36.5,37.57 35.13,36.2 35.13,30.4 PIC32MX250/270.5
  Bottom 0.152: v49.3,40.54 62.1,40.54 68.66,33.98 68.66,30.63 69.5,29.79 70.33,29.79 71.02,29.11 71.02,17.91 70.18,17.07 69.34,17.07 68.51,16.23 68.51,15.39 67.67,14.55 65.15,14.55 62.71,12.12 48.24,12.12 47.02,13.34 JP7.7
RESET  (via drill 0.33)
  Top 0.152: R4.2 50.6,4.42 49.91,4.42 47.17,1.68 40.84,1.68 39.4,3.12 LEFT.4 v37.26,1.07 | 26.4,23.2 24.16,20.95 PICKIT3.1 | 26.4,23.2 27.13,23.93 28.65,23.93 PIC32MX250/270.18 | RIGHT.4 26.67,37.64 22.94,33.91 22.94,25.53 23.78,24.69 24.92,24.69 26.4,23.2
  Bottom 0.152: v37.26,1.07 27.05,1.07 25.3,2.82 25.3,19.81 24.16,20.95 PICKIT3.1
VBUS  (via drill 0.33)
  Top 0.152: v36.5,27.05 36.58,27.13 39.85,27.13 PIC32MX250/270.42 | v12.35,36.2 10.82,34.67 D1.A | v8.69,33.53 7.93,32.77 CN1.VBUS
  Bottom 0.152: v36.5,27.05 25.3,38.25 25.3,39.24 23.85,40.69 16.84,40.69 v12.35,36.2 9.68,33.53 v8.69,33.53
VCAP
  Top 0.152: PIC32MX250/270.7 33.45,30.4 33.45,30.94 31.4,32.99 31.01,32.99 C5.A
VDD  (via drill 0.33)
  Top 0.203: D3.A 15.24,33.38 14.25,32.38 14.25,30.79 15.17,29.87 15.32,29.87 15.47,29.72 15.47,28.04 | 15.47,28.04 14.1,26.67 X1117_3V3.2 | 15.47,28.04 15.55,28.04 16.92,26.67 X1117_3V3.4 21.26,26.67 24.39,23.55 PICKIT3.2 | v25.68,24.77 PIC32MX250/270.17 | PIC32MX250/270.28 34.29,20.19 v34.06,20.42 | v12.42,24.61 10.82,24.61 C2.1 | R11.2 59.74,19.89 62.18,19.89 R12.2 | R9.2 62.18,22.78 59.74,22.78 R8.2 59.59,22.71 56.77,22.71 56.31,22.25 52.12,22.25 | R12.2 62.18,19.96 62.18,22.63 R9.2 | R9.2 62.18,22.86 62.18,23.39 67.36,28.57 I2C.2 I2C1.2 | ESP8266.2 67.29,10.82 67.29,11.66 63.63,15.32 63.63,18.67 62.56,19.74 62.26,19.74 R12.2 | 41.76,25.53 44.96,25.53 45.19,25.3 46.25,25.3 JP7.2 47.02,25.98 47.86,25.98 49,24.84 52.12,24.84 | 41.76,25.53 39.93,25.53 PIC32MX250/270.40 | PIC32MX250/270.10 31.09,29.03 31.62,28.5 38.25,28.5 39.09,29.34 41.45,29.34 41.76,29.03 41.76,25.53 | 52.05,5.64 52.05,10.74 JP12.8 52.12,10.82 52.12,13.26 JP12.7 52.12,13.34 52.12,15.85 JP12.6 52.12,15.93 52.12,18.36 JP12.5 52.12,18.44 52.12,20.88 JP12.4 52.12,20.95 52.12,22.25 | 52.05,5.64 52.05,3.73 50.67,2.36 50.67,1.91 R3.2 | 52.05,5.64 47.7,5.64 45.26,3.2 44.5,3.2 LEFT.2 | 52.12,22.25 52.12,23.47 JP12.3 52.12,23.55 52.12,24.84 | 52.12,24.84 52.12,25.98 JP12.2 52.12,26.06 52.12,28.5 JP12.1 52.05,28.57 52.05,38.18 50.67,39.55 50.67,40.01 R2.1 50.67,40.08 49.61,41.15 24.31,41.15 21.95,38.79 21.64,38.79 RIGHT.2
  Bottom 0.203: v34.06,20.42 31.93,20.42 27.59,24.77 v25.68,24.77 24.39,23.47 PICKIT3.2 24.31,23.55 23.24,24.61 21.64,24.61 | 21.64,24.61 v12.42,24.61 | 21.64,24.61 21.64,38.71 RIGHT.2
YELLOW
  Top 0.152: D6.C 45.34,34.98 50.6,34.98 R7.1
YELLOW1
  Top 0.152: R10.1 D5.C

### Text on the board
tNames: HelvePic32 V2.0f SMD44 | PIC32MX250F128D/MX270F256D | G | 3V | 5V | R | 7 | 6 | 5 | 4 | 3 | 2 | 1 | 0 | G | 3V | 5V | R | 7 | 6 | 5 | 4 | 3 | 2 | 1 | 0 | NC | SCL | SDA | SCL | SCL | RB1 | SDA | SDA | GND | RB0 | 7 | pull-up | VCC | VCC | 3V3 | 6 | GND | GND | GND | 5V | 5 | CC-BY-SA / Creative Commons 4.0 | TX | RX | VCC | 12 | I2C2 | RST | 4 | TX | RX | 11 | GND | 3 | TX-> RXpic | 10 | NC | 2 | SCL | SDA | PDN | 9 | NC | 1 | RST | 8 | pull-up | TXpic ->RX | 0 | Vcc | VCC | GND | 0 | 1 | 2 | 3 | 4 | 5 | 6 | 7 | R | 5V | 3V | G | 0 | 1 | 2 | 3 | 4 | 5 | 6 | 7 | R | 5V | 3V | G | www.boxtec.ch